# EAGLE design magicmouth-v0.1-ss (EAGLE 6.3)
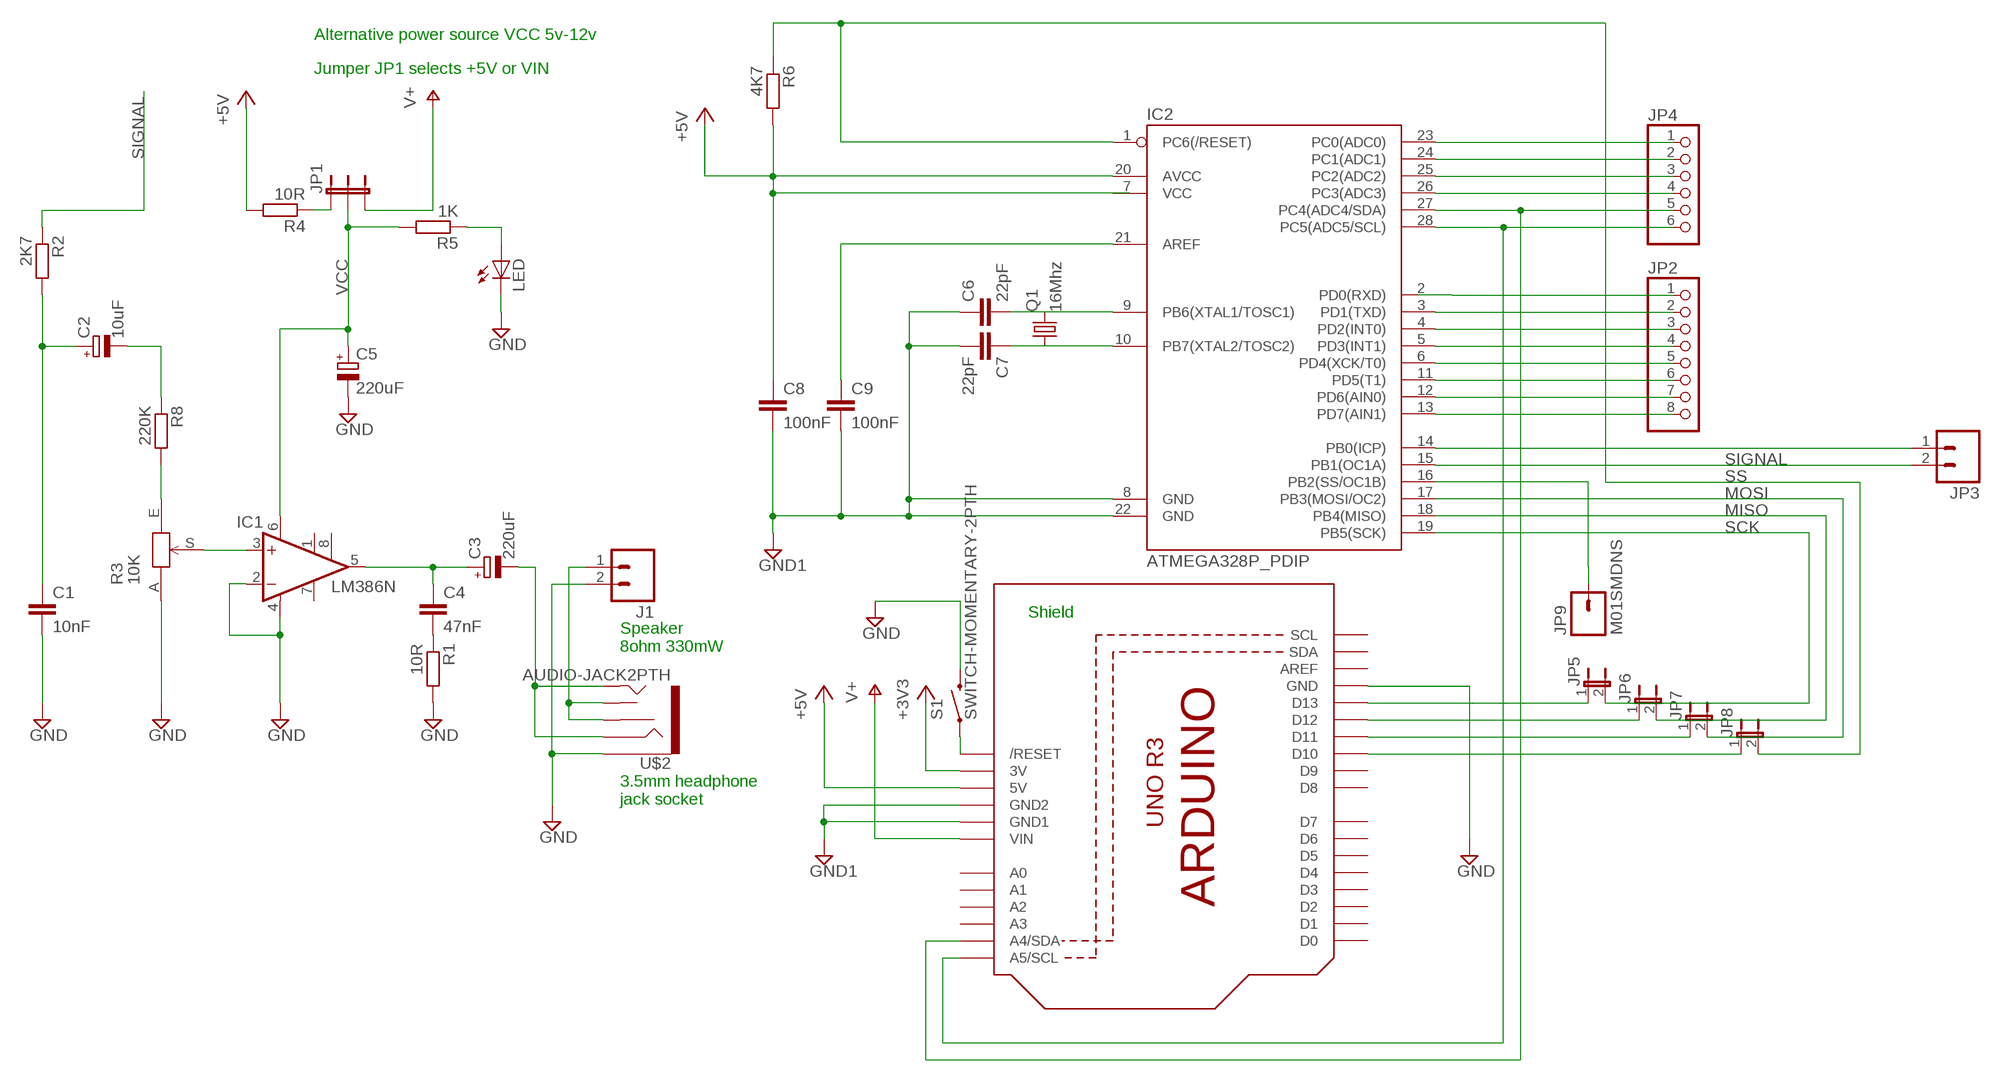
[diagram p0: schematic, sheet 1]

## Parts
C1  10nF  C-EU050-025X075  [C050-025X075]
C2  10uF  CPOL-EUE2.5-7  [E2,5-7]
C3  220uF  CPOL-EUTT5D7L  [TT5D7L]
C4  47nF  C-EU050-025X075  [C050-025X075]
C5  220uF  CPOL-EUTT5D7L  [TT5D7L]
C6  22pF  C-EU025-025X050  [C025-025X050]
C7  22pF  C-EU025-025X050  [C025-025X050]
C8  100nF  C-EU025-025X050  [C025-025X050]
C9  100nF  C-EU025-025X050  [C025-025X050]
IC1  LM386N  LM386N-1  [DIL08]
IC2  ATMEGA328P_PDIP  [DIL28-3]
J1  M023.5MM  [SCREWTERMINAL-3.5MM-2]
JP1  JUMPER-3PTH  [1X03]
JP2  PINHD-1X8CLEANBIG  [1X08-CLEANBIG]
JP3  M021X02_NO_SILK  [1X02_NO_SILK]
JP4  PINHD-1X6CB  [1X06-CLEANBIG]
JP5  JUMPER-2PTH  [1X02]
JP6  JUMPER-2PTH  [1X02]
JP7  JUMPER-2PTH  [1X02]
JP8  JUMPER-2PTH  [1X02]
JP9  M01SMDNS  [1X01NS]
LED  LED3MM  [LED3MM]
Q1  16Mhz  CRYSTALHC49S  [HC49/S]
R1  10R  R-EU_0207/7  [0207/7]
R2  2K7  R-EU_0207/7  [0207/7]
R3  10K  TPOT3352  [3352T]
R4  10R  R-EU_0207/7  [0207/7]
R5  1K  R-EU_0207/7  [0207/7]
R6  4K7  R-EU_0207/7  [0207/7]
R8  220K  R-EU_0207/7  [0207/7]
S1  SWITCH-MOMENTARY-2PTH  [TACTILE-PTH]
U1  ARDUINOR3-NOIOREF-NOTEXT  [ARDUINOR3-NOTEXT-NOIOREF]
U$2  AUDIO-JACK2PTH  [AUDIO-JACK]

## Nets
+3V3: U1.3V
+5V: C8.1 IC2.20(AVCC) R4.2 R6.2 U1.5V
GND: C1.2 C5.- IC1.2(-IN) IC1.4(GND) J1.2 LED.K(C) R1.2 R3.A S1.3 U1.GND U$2.SLEEVE
GND1: C6.1 C7.2 C8.2 C9.2 IC2.8(GND) IC2.22(GND) U1.GND1 U1.GND2
MISO: IC2.18(PB4(MISO)) JP6.2
MOSI: IC2.17(PB3(MOSI/OC2)) JP7.2
N$1: C3.+ C4.1 IC1.5(OUT)
N$2: C1.1 C2.+ R2.2
N$3: J1.1 U$2.RSH U$2.TSH
N$4: C4.2 R1.1
N$5: C2.- R8.1
N$6: C6.2 IC2.9(PB6(XTAL1/TOSC1)) Q1.2
N$7: JP1.1 R4.1
N$8: C3.- U$2.RING U$2.TIP
N$9: IC1.3(+IN) R3.S
N$10: LED.A R5.1
N$11: C7.1 IC2.10(PB7(XTAL2/TOSC2)) Q1.1
N$12: IC2.16(PB2(SS/OC1B)) JP9.1
N$13: IC2.23(PC0(ADC0)) JP4.1
N$14: IC2.24(PC1(ADC1)) JP4.2
N$15: IC2.25(PC2(ADC2)) JP4.3
N$16: JP2.1
N$17: IC2.3(PD1(TXD)) JP2.2
N$18: IC2.4(PD2(INT0)) JP2.3
N$19: IC2.5(PD3(INT1)) JP2.4
N$20: IC2.6(PD4(XCK/T0)) JP2.5
N$21: IC2.11(PD5(T1)) JP2.6
N$22: IC2.12(PD6(AIN0)) JP2.7
N$23: IC2.13(PD7(AIN1)) JP2.8
N$24: IC2.14(PB0(ICP)) JP3.1
N$25: JP5.1 U1.D13
N$26: JP6.1 U1.D12
N$27: IC2.26(PC3(ADC3)) JP4.4
N$28: JP7.1 U1.D11
N$29: JP8.1 U1.D10
N$30: IC2.27(PC4(ADC4/SDA)) JP4.5 U1.A4(A4/SDA)
N$31: IC2.28(PC5(ADC5/SCL)) JP4.6 U1.A5(A5/SCL)
N$34: C9.1 IC2.21(AREF)
N$35: S1.1 U1.RESET(/RESET)
N$36: R3.E R8.2
SCK: IC2.19(PB5(SCK)) JP5.2
SIGNAL: IC2.15(PB1(OC1A)) JP3.2 R2.1
SS: IC2.1(PC6(/RESET)) JP8.2 R6.1
VCC: C5.+ IC1.6(VS) JP1.2 R5.2
VIN: JP1.3 U1.VIN ; supply symbol labelled V+
Unconnected: IC1.1(GAIN) IC1.7(BYPASS) IC1.8(GAIN) IC2.2(PD0(RXD)) IC2.7(VCC) U1.A0 U1.A1 U1.A2 U1.A3 U1.AREF U1.D0 U1.D1 U1.D2 U1.D3 U1.D4 U1.D5 U1.D6 U1.D7 U1.D8 U1.D9 U1.SCL U1.SDA

## Notes on the sheet
- Alternative power source VCC 5v-12v
- Jumper JP1 selects +5V or VIN
- Shield
- Speaker
  8ohm 330mW
- 3.5mm headphone
  jack socket

## Library data of the parts
C1 C4 = resistor:C-EU: CAPACITOR, European symbol
C2 C3 C5 = rcl:CPOL-EU: POLARIZED CAPACITOR, European symbol
C6 C7 = rcl:C-EU: CAPACITOR, European symbol; CAPACITANCE: 22 pf
C8 = rcl:C-EU: CAPACITOR, European symbol; CAPACITANCE: 10 nF
C9 = rcl:C-EU: CAPACITOR, European symbol; CAPACITANCE: 100 nF
IC1 = linear:LM386?-*: Low Voltage Audio Power Amplifier Source: http://cache.national.com/ds/LM/LM386.pdf
IC2 = SparkFun-DigitalIC:ATMEGA328P_PDIP: uC used in the Arduino 32kb flash, 1k EEPROM, 2k SRAM This is the through-hole version of this chip.
J1 JP3 = SparkFun-Connectors:M02: Header 2 Standard 2-pin 0.1" header. Use with straight break away headers (SKU : PRT-00116), right angle break away headers (PRT-00553), swiss pins (PRT-00743), machine pins (PRT-00117), and female headers (PRT-00115). Molex polarized connector foot print use with SKU : PRT-08233 with associated crimp pins and housings.
JP1 = SparkFun-Passives:JUMPER-3
JP2 = adafruit:PINHD-1X8: PIN HEADER
JP4 = adafruit:PINHD-1X6: PIN HEADER
JP5-JP8 = SparkFun-Passives:JUMPER-2: Jumper Basic 0.1" spaced jumper. Use with breakaway headers.
JP9 = SparkFun-Connectors:M01: Header 1 Standard 1-pin 0.1" header. Use with straight break away headers (SKU : PRT-00116), right angle break away headers (PRT-00553), swiss pins (PRT-00743), machine pins (PRT-00117), and female headers (PRT-00115).
LED = led:LED: LED OSRAM: - CHIPLED LG R971, LG N971, LY N971, LG Q971, LY Q971, LO R971, LY R971 LH N974, LH R974 LS Q976, LO Q976, LY Q976 LO Q996 - Hyper CHIPLED LW Q18S LB Q993, LB Q99A, LB R99A - SideLED LS A670, LO A670, LY A670, LG A670, LP A670 LB A673, LV A673, LT A673, LW A673 LH A674 LY A675 LS A676, LA A676, LO A676, LY A676, LW A676 LS A679, LY A679, LG A679 - Hyper Micro SIDELED® LS Y876, LA Y876, LO Y876, LY Y876 LT Y87S - SmartLED LW L88C, LW L88S LB L89C, LB L89S, LG L890 LS L89K, LO L89K, LY L89K LS L896, LA L896, LO L896, LY L896 - TOPLED LS T670, LO T670, LY T670, LG T670, LP T670 LSG T670, LSP T670, LSY T670, LOP T670, LYG T670 LG T671, LOG T671, LSG T671 LB T673, LV T673, LT T673, LW T673 LH T674 LS T676, LA T676, LO T676, LY T676, LB T676, LH T676, LSB T676, LW T676 LB T67C, LV T67C, LT T67C, LS T67K, LO T67K, LY T67K, LW E67C LS E67B, LA E67B, LO E67B, LY E67B, LB E67C, LV E67C, LT E67C LW T67C LS T679, LY T679, LG T679 LS T770, LO T770, LY T770, LG T770, LP T770 LB T773, LV T773, LT T773, LW T773 LH T774 LS E675, LA E675, LY E675, LS T675 LS T776, LA T776, LO T776, LY T776, LB T776 LHGB T686 LT T68C, LB T68C - Hyper Mini TOPLED® LB M676 - Mini TOPLED Santana® LG M470 LS M47K, LO M47K, LY M47K Source: http://www.osram.convergy.de - LUMILED® LXK2-PW12-R00, LXK2-PW12-S00, LXK2-PW14-U00, LXK2-PW14-V00 LXK2-PM12-R00, LXK2-PM12-S00, LXK2-PM14-U00 LXK2-PE12-Q00, LXK2-PE12-R00, LXK2-PE12-S00, LXK2-PE14-T00, LXK2-PE14-U00 LXK2-PB12-K00, LXK2-PB12-L00, LXK2-PB12-M00, LXK2-PB14-N00, LXK2-PB14-P00, LXK2-PB14-Q00 LXK2-PR12-L00, LXK2-PR12-M00, LXK2-PR14-Q00, LXK2-PR14-R00 LXK2-PD12-Q00, LXK2-PD12-R00, LXK2-PD12-S00 LXK2-PH12-R00, LXK2-PH12-S00 LXK2-PL12-P00, LXK2-PL12-Q00, LXK2-PL12-R00 Source: www.luxeon.com
Q1 = crystal:CRYSTAL: CRYSTAL; OC_FARNELL: 1667008; OC_NEWARK: unknown
R1 = resistor:R-EU_: RESISTOR, European symbol
R2 R4 R5 R8 = rcl:R-EU_: RESISTOR, European symbol
R3 = t0mpr1c3:TPOT: Bourns thumbwheel trimmer resistor
R6 = rcl:R-EU_: RESISTOR, European symbol; RESISTANCE: 4K7
S1 = SparkFun-Electromechanical:SWITCH-MOMENTARY-2: Various NO switches- pushbuttons, reed, etc
U1 = adafruit:ARDUINOR3-NOIOREF
U$2 = SparkFun-Connectors:AUDIO-JACK2: Stereo audio jack with bypass switches.

## Board
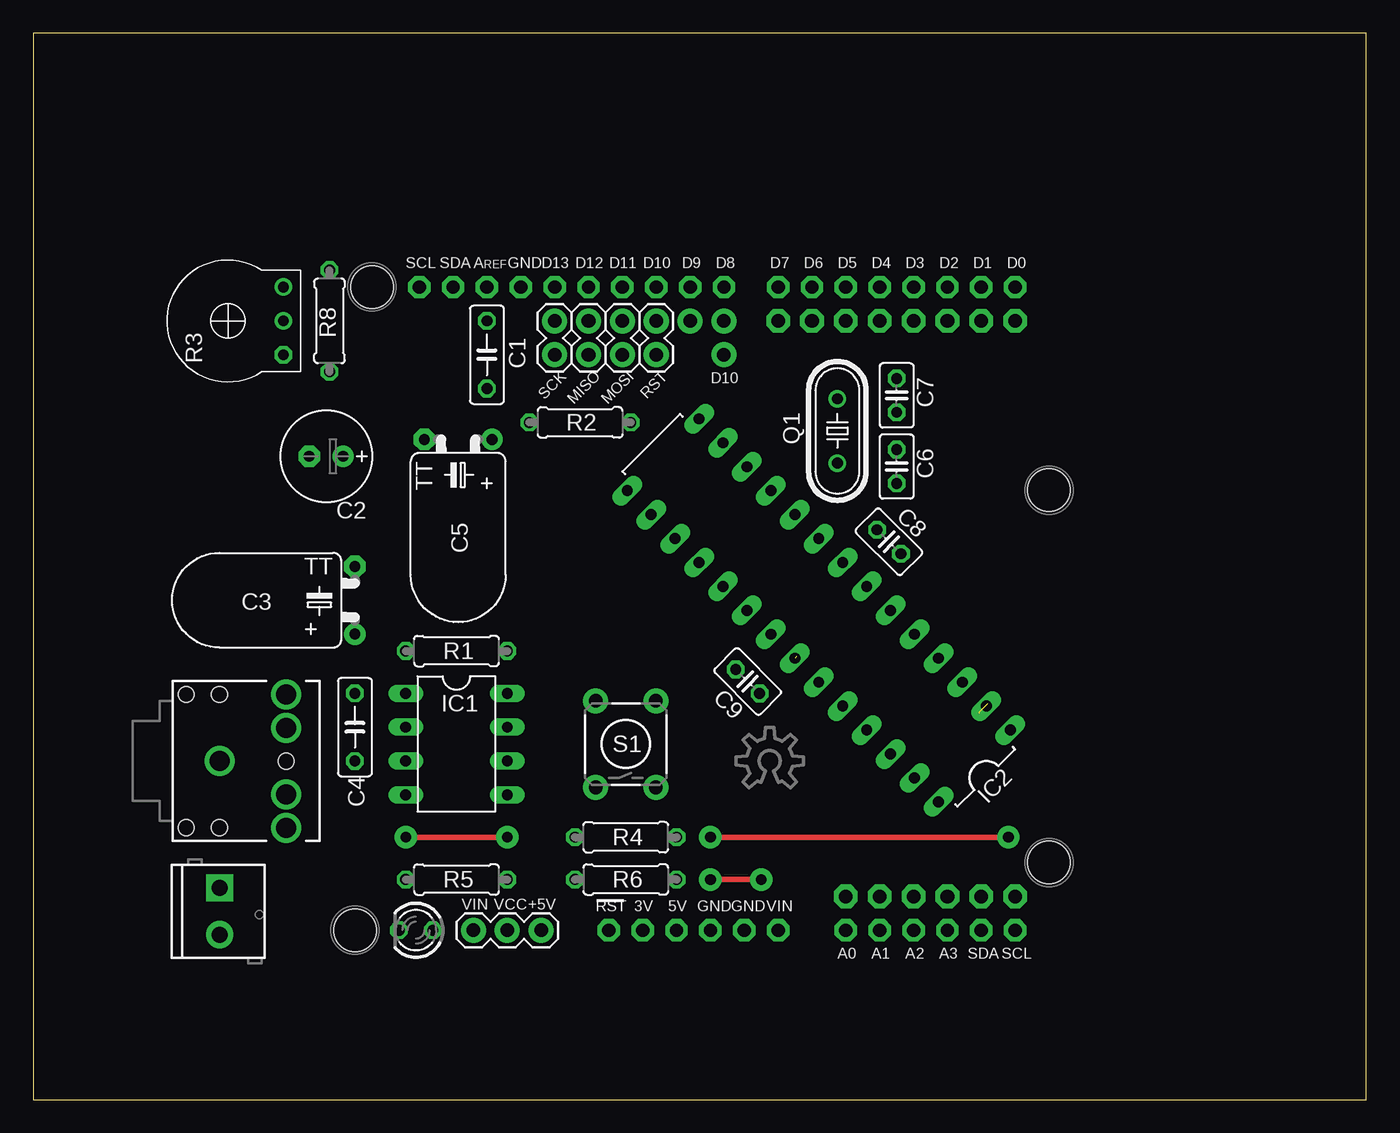
[diagram p1: board, top side]
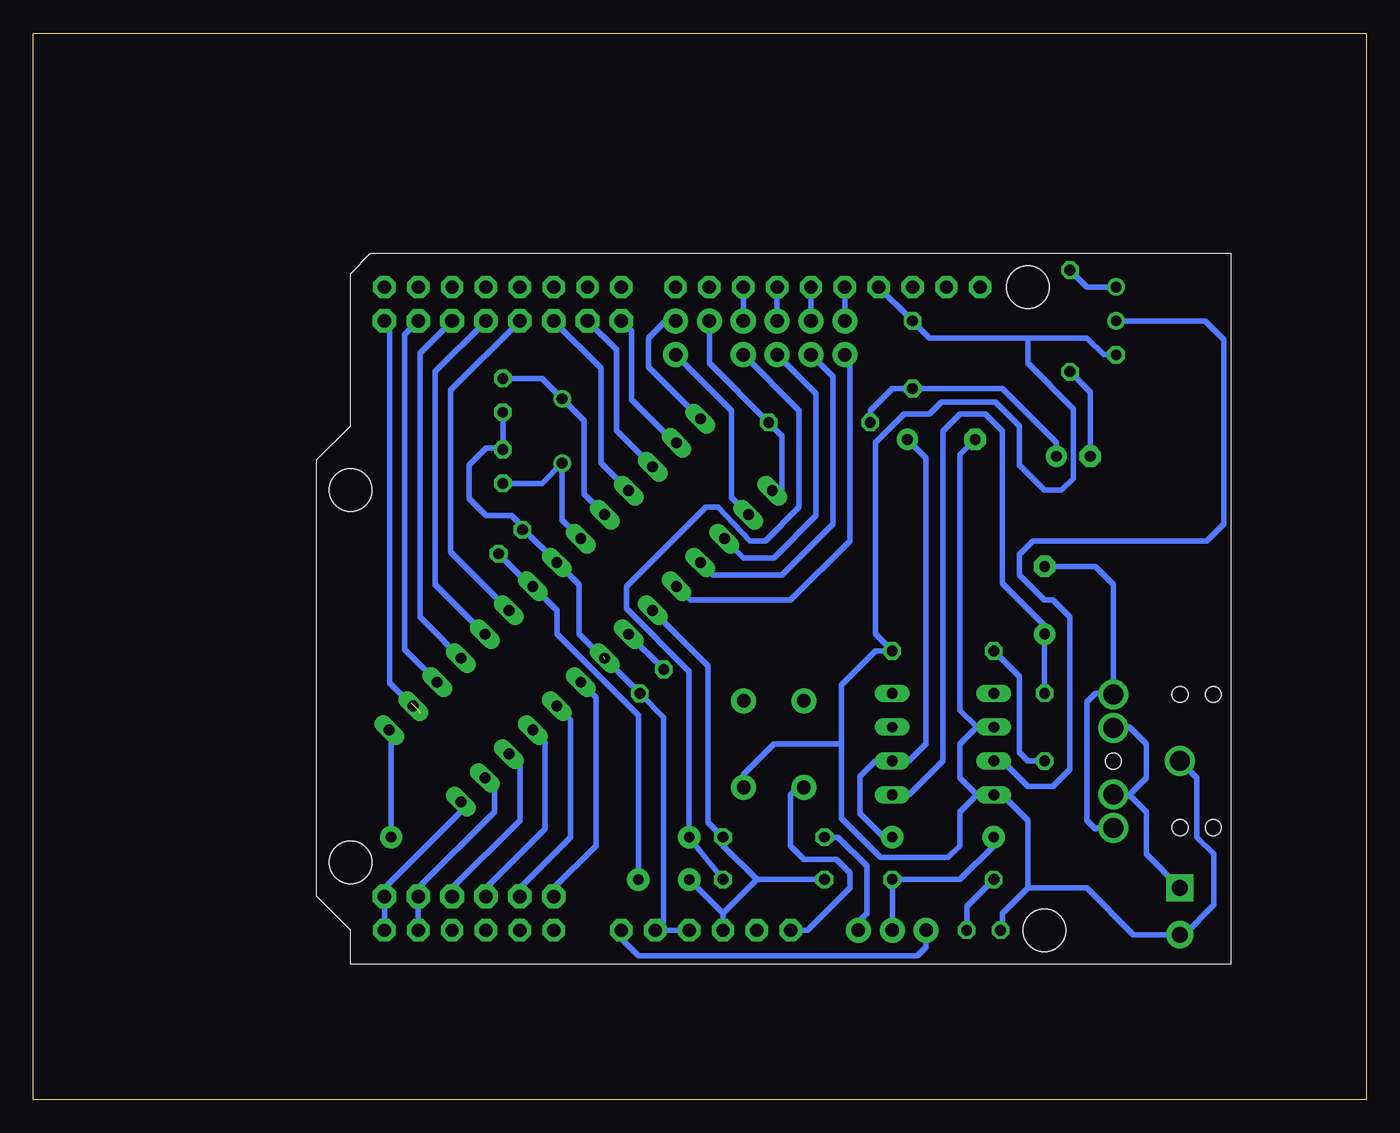
[diagram p2: board, bottom side, seen from below]

Size 100 x 80 mm. Coordinates in mm from the lower left corner, seen from the top.
Outline: 0,0 100,0 100,80 0,80 0,0
Copper layers (1*16): Top 0.035mm / dielectric 1.5mm / Bottom 0.035mm
Design rules "default *": minimum track width 10mil, minimum drill 19mil, track to track 8mil, track to pad 8mil, pad to pad 8mil, via to via 8mil, smd to smd 8mil, copper to edge 40mil, drill to drill 8mil, minimum pad ring 10mil, minimum via ring 8mil, stop-mask expansion 4mil, vias tented up to drill 0mil, thermal gap 10mil
Holes 3.2 mm at 24.13,12.7 25.4,60.96 76.2,45.72 76.2,17.78

### Footprints (pad centres in the part's own frame; a part is rotated, then mirrored left to right if it is on the bottom)
C050-025X075 = drill 0.813 octagon: 1 -2.54,0; 2 2.54,0
E2,5-7 = drill 0.813 pad 1.6: + -1.27,0 | drill 0.813 pad 1.6 octagon: - 1.27,0
TT5D7L = drill 0.813 pad 1.6: + -2.54,0 | drill 0.813 pad 1.6 octagon: - 2.54,0
C025-025X050 = drill 0.813 octagon: 1 -1.27,0; 2 1.27,0
DIL08 = drill 0.813 long: 1 -3.81,-3.81; 2 -1.27,-3.81; 3 1.27,-3.81; 4 3.81,-3.81; 5 3.81,3.81; 6 1.27,3.81; 7 -1.27,3.81; 8 -3.81,3.81
DIL28-3 = drill 0.813 long: 1 -16.51,-3.81; 2 -13.97,-3.81; 3 -11.43,-3.81; 4 -8.89,-3.81; 5 -6.35,-3.81; 6 -3.81,-3.81; 7 -1.27,-3.81; 8 1.27,-3.81; 9 3.81,-3.81; 10 6.35,-3.81; 11 8.89,-3.81; 12 11.43,-3.81; 13 13.97,-3.81; 14 16.51,-3.81; 15 16.51,3.81; 16 13.97,3.81; 17 11.43,3.81; 18 8.89,3.81; 19 6.35,3.81; 20 3.81,3.81; 21 1.27,3.81; 22 -1.27,3.81; 23 -3.81,3.81; 24 -6.35,3.81; 25 -8.89,3.81; 26 -11.43,3.81; 27 -13.97,3.81; 28 -16.51,3.81
SCREWTERMINAL-3.5MM-2 = drill 1.2 pad 2.032 square: 1 0,0 | drill 1.2 pad 2.032: 2 3.5,0
1X03 = drill 1.016 pad 1.88: 1 0,0; 2 2.54,0; 3 5.08,0
1X08-CLEANBIG = drill 1.016 pad 1.778 octagon: 1 -8.89,0; 2 -6.35,0; 3 -3.81,0; 4 -1.27,0; 5 1.27,0; 6 3.81,0; 7 6.35,0; 8 8.89,0
1X02_NO_SILK = drill 1.016 pad 1.88: 1 0,0; 2 2.54,0
1X06-CLEANBIG = drill 1.016 pad 1.778 octagon: 1 -6.35,0; 2 -3.81,0; 3 -1.27,0; 4 1.27,0; 5 3.81,0; 6 6.35,0
1X02 = drill 1.016 pad 1.88: 1 0,0; 2 2.54,0
1X01NS = drill 1.016 pad 1.88: 1 0,0
LED3MM = drill 0.813 octagon: A -1.27,0; K 1.27,0
HC49/S = drill 0.813: 1 -2.413,0; 2 2.413,0
0207/7 = drill 0.813 octagon: 1 -3.81,0; 2 3.81,0
3352T = drill 0.8 pad 1.27 octagon: A -2.54,-4.16 | drill 0.8 pad 1.27: E 2.54,-4.16; S 0,-4.16
TACTILE-PTH = drill 1.016 pad 1.88: 1 -3.251,2.261; 2 3.251,2.261; 3 -3.251,-2.261; 4 3.251,-2.261
ARDUINOR3-NOTEXT-NOIOREF = drill 1 pad 1.676 octagon: 3V 35.56,2.54; 5V 38.1,2.54; A0 50.8,2.54; A1 53.34,2.54; A2 55.88,2.54; A3 58.42,2.54; A4 60.96,2.54; A5 63.5,2.54; AREF 23.876,50.8; D0 63.5,50.8; D1 60.96,50.8; D2 58.42,50.8; D3 55.88,50.8; D4 53.34,50.8; D5 50.8,50.8; D6 48.26,50.8; D7 45.72,50.8; D8 41.656,50.8; D9 39.116,50.8; D10 36.576,50.8; D11 34.036,50.8; D12 31.496,50.8; D13 28.956,50.8; GND 26.416,50.8; GND1 43.18,2.54; GND2 40.64,2.54; RESET 33.02,2.54; SCL 18.796,50.8; SDA 21.336,50.8; VIN 45.72,2.54
AUDIO-JACK = drill 1.5 pad 2.184: RING 5,5; RSH 5,2.5; SLEEVE 0,0; TIP 5,-5; TSH 5,-2.5 | hole 1.2: 0,5; -2.5,5; -2.5,-5; 0,-5; 5,0

### Placement (x,y rotation side)
C1  34.04,55.88 90 top
C2  21.97,48.26 180 top
C3  24.13,37.47 90 top
C4  24.13,27.94 270 top
C5  31.88,49.53 180 top
C6  64.77,47.5 270 top
C7  64.77,52.83 270 top
C8  64.2,41.85 135 top
C9  53.59,31.37 315 top
IC1  31.75,26.67 270 top
IC2  58.93,36.7 135 top
J1  13.97,15.88 270 top
JP1  38.1,12.7 180 top
JP2  64.77,58.42 180 top
JP3  51.82,58.42 180 top
JP4  67.31,15.24 0 top
JP5  39.12,58.42 270 top
JP6  41.66,58.42 270 top
JP7  44.2,58.42 270 top
JP8  46.74,58.42 270 top
JP9  51.82,55.88 0 top
LED  28.7,12.7 180 top
Q1  60.33,50.16 270 top
R1  31.75,33.66 0 top
R2  41.02,50.8 180 top
R3  14.61,58.42 90 top
R4  44.45,19.68 0 top
R5  31.75,16.51 0 top
R6  44.45,16.51 180 top
R8  22.23,58.42 90 top
S1  44.45,26.67 90 top
U1  10.16,10.16 0 top
U$1  [OSHWLOGO_TOL_0.2]  55.24,25.4 0 top
U$2  13.97,25.4 0 top

### Tracks (layer width: path | path; a pad name or v marks a point on that pad's centre or on a via)
+5V  (via drill 0.8 pad 1.68)
  Top 0.406: v50.8,16.51 v54.61,16.51
  Bottom 0.406: U1.5V 48.26,13.97 | 48.26,13.97 v50.8,16.51 | v54.61,16.51 54.61,28.83 60.71,34.92 60.71,36.69 62.76,38.73 62.88,38.73 C8.1 | 45.72,16.51 48.26,13.97 | 45.72,16.51 48.26,19.05 R4.2 49.38,20.8 49.38,32.54 IC2.20 | R6.2 45.72,16.51
GND
  Bottom 0.254: 34.16,58.55 34.29,58.42 C1.2
  Bottom 0.406: IC1.2 29.21,27.94 | 29.21,27.94 30.48,26.67 30.48,24.13 29.21,22.86 | 29.21,22.86 IC1.4 27.3,22.86 25.4,20.95 25.4,15.88 | 29.21,27.94 30.48,29.21 30.48,48.39 C5.- | U1.GND 34.16,58.55 C1.2 32.77,57.15 25.4,57.15 | 25.4,15.88 27.3,13.97 27.3,12.83 LED.K | 25.4,15.88 20.95,15.88 17.45,12.38 J1.2 13.66,12.38 11.43,14.61 11.43,18.41 12.7,19.68 12.7,24.13 U$2.SLEEVE | 29.21,22.86 30.48,21.59 30.48,19.05 31.37,18.16 36.45,18.16 39.37,21.08 39.37,26.67 | R1.2 36.83,33.66 39.37,31.11 39.37,26.67 | R1.2 35.43,33.66 35.31,33.78 | S1.3 46.71,24.41 44.45,26.67 39.37,26.67 | R3.A 19.68,55.88 20.95,57.15 25.4,57.15 | 25.4,57.15 25.4,55.24 21.97,51.82 21.97,46.61 22.86,45.72 24.13,45.72 26.04,47.62 26.04,50.55 27.81,52.32 31.88,52.32 32.77,51.44 34.67,51.44 36.83,49.28 36.83,34.92 R1.2
GND1  (1 unrouted)
  Bottom 0.406: U1.GND2 U1.GND1 52.7,13.34 52.7,28.68 C9.2 57.26,33.24 | C7.2 C6.1 64.9,48.9 66.04,48.9 67.31,47.62 67.31,45.09 66.04,43.81 64.14,43.81 63.3,42.98 C8.2 63.17,42.74 IC2.8 59.05,38.63 59.05,34.92 56.73,32.6 IC2.22
MISO
  Bottom 0.406: JP6.2 40.01,54.23 40.01,43.18 43.81,39.37 49.02,39.37 IC2.18
MOSI
  Bottom 0.406: JP7.2 41.27,52.96 41.27,43.81 44.45,40.64 46.7,40.64 IC2.17
N$1
  Bottom 0.406: IC1.5 34.29,22.86 31.75,25.4 31.75,50.16 30.48,51.44 28.57,51.44 27.3,50.16 27.3,38.73 24.13,35.56 C3.+ C4.1
N$2
  Bottom 0.406: C2.+ 23.24,49.28 27.3,53.34 C1.1 35.56,53.34 37.21,51.69 R2.2
N$3
  Bottom 0.406: J1.1 16.51,18.41 16.51,21.59 17.78,22.86 18.93,22.86 U$2.TSH 17.74,22.9 16.51,24.13 16.51,26.67 17.78,27.94 18.93,27.94 U$2.RSH
N$4
  Bottom 0.406: C4.2 25.4,25.4 26.04,26.04 26.04,31.75 R1.1
N$5
  Bottom 0.406: C2.- 20.7,53.09 R8.1
N$6
  Bottom 0.406: C6.2 61.85,46.23 Q1.2 60.33,43.49 IC2.9
N$7
  Bottom 0.406: R4.1 39.62,19.68 37.47,17.53 37.47,13.97 38.1,13.34 JP1.1
N$8
  Bottom 0.406: C3.- 20.32,40.01 18.97,38.66 U$2.RING 19.05,30.48 20.32,30.48 20.95,29.84 20.95,20.95 20.32,20.32 20.24,20.4 U$2.TIP
N$9
  Bottom 0.406: 19.05,58.42 R3.S 12.06,58.42 10.67,57.02 10.67,43.18 11.94,41.91 25.02,41.91 26.04,40.89 26.04,39.37 24.13,37.47 23.5,37.47 22.23,36.2 22.23,24.77 23.5,23.5 25.4,23.5 27.3,25.4 IC1.3
N$10
  Bottom 0.406: LED.A 29.97,14.48 R5.1
N$11
  Bottom 0.406: C7.1 61.85,54.1 Q1.1 58.67,50.93 58.67,45.43 IC2.10
N$12
  Bottom 0.406: JP9.1 47.62,51.69 47.62,45.16 IC2.16
N$13
  Bottom 0.406: JP4.1 60.96,15.88 57.78,19.05 57.78,30.17 IC2.23
N$14
  Bottom 0.406: JP4.2 63.5,15.88 59.69,19.68 59.69,28.48 IC2.24
N$15
  Bottom 0.406: JP4.3 66.04,15.88 61.59,20.32 61.59,26.8 IC2.25
N$16  (3 unrouted)
  Bottom 0.406: JP2.1 73.28,58.04 73.28,31.24 70.99,28.96
N$17
  Bottom 0.406: JP2.2 72.14,57.4 72.14,33.78 69.2,30.84 IC2.3
N$18
  Bottom 0.406: JP2.3 70.99,56.01 70.99,36.2 67.4,32.6 IC2.4
N$19
  Bottom 0.406: JP2.4 69.85,54.61 69.85,38.61 69.81,38.61 IC2.5
N$20
  Bottom 0.406: JP2.5 68.71,53.21 68.71,41.09 IC2.6
N$21
  Bottom 0.406: JP2.6 57.4,54.86 57.4,47.75 IC2.11
N$22
  Bottom 0.406: JP2.7 56.26,56.26 56.26,50.2 IC2.12
N$23
  Bottom 0.406: JP2.8 55.12,57.66 55.12,52.52 51.36,48.77 IC2.13
N$24
  Bottom 0.406: JP3.1 52.58,58.42 53.85,57.15 53.85,54.97 IC2.14
N$25
  Bottom 0.406: JP5.1 U1.D13
N$26
  Bottom 0.406: JP6.1 U1.D12
N$27
  Bottom 0.406: JP4.4 68.58,15.88 63.5,20.95 63.5,25.11 IC2.26
N$28
  Bottom 0.406: JP7.1 U1.D11
N$29
  Bottom 0.406: JP8.1 U1.D10
N$30
  Bottom 0.406: U1.A4 JP4.5 71.12,15.88 65.41,21.59 65.41,23.42 IC2.27
N$31
  Bottom 0.406: IC2.28 67.94,22.3 67.94,21.59 73.66,15.88 JP4.6 U1.A5
N$34
  Bottom 0.406: C9.1 | C9.1 IC2.21
N$35
  Bottom 0.406: U1.RESET 41.91,12.7 38.73,15.88 38.73,17.02 39.75,18.03 42.16,18.03 43.18,19.05 43.18,22.86 42.62,23.42 S1.1
N$36
  Bottom 0.406: R3.E 20.95,60.96 R8.2
SCK
  Bottom 0.406: JP5.2 38.73,55.5 38.73,41.91 43.18,37.47 50.71,37.47 IC2.19
SIGNAL
  Bottom 0.406: JP3.2 49.28,55.24 R2.1 43.81,49.78 43.81,45.41 IC2.15
SS  (via drill 0.8 pad 1.68)
  Top 0.406: v50.8,19.68 v73.15,19.68
  Bottom 0.406: JP8.2 42.55,51.69 42.55,44.45 45.09,41.91 46.23,41.91 48.64,44.45 49.53,44.45 55.5,38.48 55.5,36.83 50.8,32.13 v50.8,19.68 R6.1 | v73.15,19.68 73.15,26.85 IC2.1
VCC  (via drill 0.8 pad 1.68)
  Top 0.406: v35.56,19.68 v27.94,19.68
  Bottom 0.406: v35.56,19.68 36.2,19.68 37.97,21.46 37.97,24.26 36.83,25.4 IC1.6 34.29,25.4 33.02,26.67 33.02,48.13 C5.+ | v27.94,19.68 27.94,19.05 30.48,16.51 R5.2 JP1.2
VIN
  Bottom 0.406: U1.VIN 55.88,12.06 54.61,10.79 33.66,10.79 33.02,11.43 JP1.3

### Text on the board
tPlace: SCL | SDA | A | REF | GND | D13 | D12 | D11 | D10 | D9 | D8 | D7 | D6 | D5 | D4 | D3 | D2 | D1 | D0 | SCK | MISO | MOSI | RST | D10 | _ | VIN | VCC | +5V | RST | 3V | 5V | GND | GND | VIN | A0 | A1 | A2 | A3 | SDA | SCL
Document: CC BY-SA 3.0
tDocu: Magic Mouth v0.1 | http://is.gd/magicmouth